# Altium schematic sheet Power_Supply.SchDoc
size A; SheetNumber: 1; SheetTotal: 10
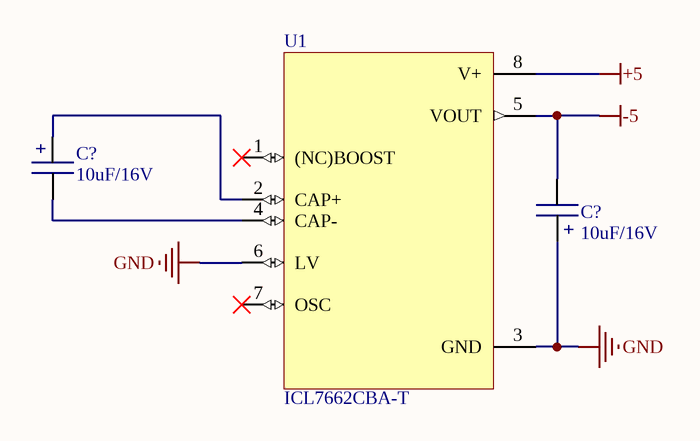
[diagram p0: Power_Supply.SchDoc]

## Parts
(Parts that share a designator on the sheet are numbered #1, #2 ... from top to bottom, then left to right.)
C?#1  10uF/16V  [TANTALUM SMD C]
C?#2  10uF/16V  [TANTALUM SMD C]
U1  ICL7662CBA-T  [SOIC127P600X175-8N]

## Nets
+5: U1.8(V+)
-5: C?#2.1 U1.5(VOUT)
GND: C?#2.2 U1.3(GND) U1.6(LV)
NetC?#1_1: C?#1.1 U1.4(CAP-)
NetC?#1_2: C?#1.2 U1.2(CAP+)

Not connected (* = marked no-connect by the designer): U1 1((NC)BOOST)* 7(OSC)*

## Notes on the sheet
- (in symbol Capacitor_Polarized_TA) +

## Library data of the parts
C?#1 C?#2 = Capacitor_Polarized_TA: Size: 2312; URL: https://www.thegioiic.com/tu-tantalum-10uf-16v-2312-tajc106k016rnj; Value: 10uF/16V
U1 = ICL7662CBA-T: Size: 8-SOIC; Value: ICL7662CBA; URL: https://www.thegioiic.com/icl7662cba